# EAGLE design RotaryEncoder (EAGLE 7.7.0)
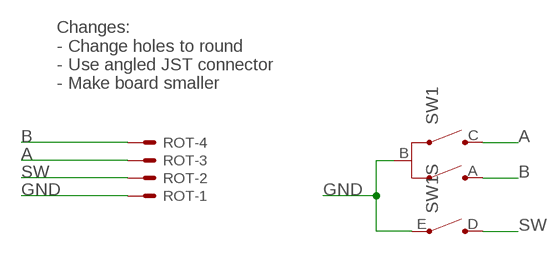
[diagram p0: schematic, sheet 1]

## Parts
ROT  JST-XH-04-PINLA  [JST-XH-04-LA]
SW1  ROTARY-ENCODER  [ROTARY-11]

## Nets
A: ROT.3 SW1.C
B: ROT.4 SW1.A
GND: ROT.1 SW1.B SW1.E
SW: ROT.2 SW1.D
Unconnected: SW1.G1(CASE1) SW1.G2(CASE2)

## Notes on the sheet
- Changes:
  - Change holes to round
  - Use angled JST connector
  - Make board smaller

## Library data of the parts
ROT = JST-XH-Pins-Swapped:JST-XH-04-PIN: JST XH Connector 2 Pin Wire to board connector. Pitch: 2,54 mm, (0.100") Number of pins: 4 Created by Rembrandt Electronics www.rembrandtelectronics.com
SW1 = MyLib:ROTARY-ENCODER: 11mm Incemental Encoder Source: www.piher.net .. 04-CI-11v04.pdf; OC_FARNELL: unknown; OC_NEWARK: unknown

## Net classes
0 default: width 0.254 mm, clearance 0.254 mm

## Board
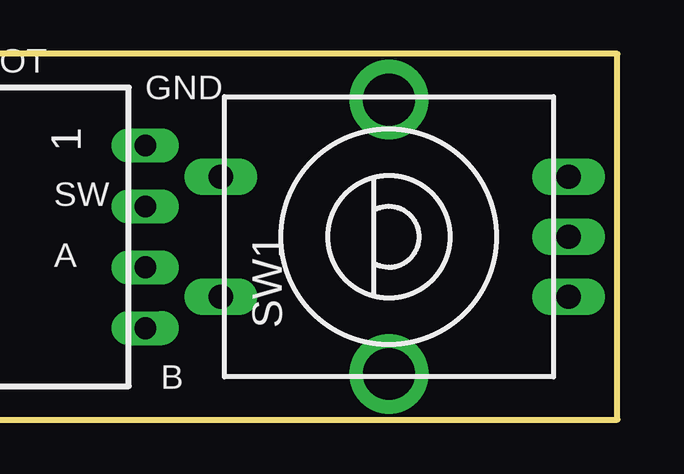
[diagram p1: board, top side]
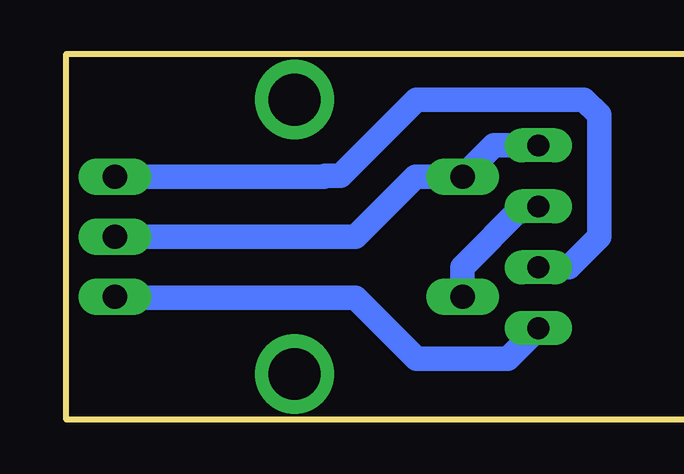
[diagram p2: board, bottom side, seen from below]

No outline drawn. Coordinates in mm, seen from the top.
Copper layers (1*16): Top 0.035mm / dielectric 1.5mm / Bottom 0.035mm
Design rules "default": minimum track width 10mil, minimum drill 24mil, track to track 8mil, track to pad 8mil, pad to pad 8mil, via to via 8mil, smd to smd 8mil, copper to edge 40mil, drill to drill 8mil, minimum pad ring 10mil, minimum via ring 8mil, stop-mask expansion 4mil, vias tented up to drill 0mil, thermal gap 10mil
Milling: 4 lines

### Footprints (pad centres in the part's own frame; a part is rotated, then mirrored left to right if it is on the bottom)
JST-XH-04-LA = drill 0.9 long: 1 -3.81,5.08; 2 -1.27,5.08; 3 1.27,5.08; 4 3.81,5.08
ROTARY-11 = drill 1.016 long: A -2.5,-7.5; B 0,-7.5; C 2.5,-7.5; D -2.5,7; E 2.5,7 | drill 2.159 pad 3.302: G1 -5.715,0; G2 5.715,0

### Placement (x,y rotation side)
ROT  2.54,7.62 270 top
SW1  17.78,7.62 90 top

### Tracks (layer width: path | path; a pad name or v marks a point on that pad's centre or on a via)
A
  Bottom 1.016: SW1.C 16.55,10.12 16.51,10.16 15.88,10.16 12.7,13.34 5.71,13.34 5.08,12.7 5.08,7.62 6.35,6.35 ROT.3
B
  Bottom 1.016: ROT.4 8.89,2.54 12.7,2.54 15.24,5.08 25.24,5.08 SW1.A
GND
  Bottom 1.016: ROT.1 9.47,11.43 SW1.E 12.74,10.12 15.24,7.62 SW1.B
SW
  Bottom 1.016: ROT.2 8.26,8.89 10.79,6.35 10.79,5.13 SW1.D

### Text on the board
Document: Components on Top
_tsilk: GND | 1 | SW | A | B